# Altium schematic sheet CW313 Power Supplies.SchDoc: Power Supplies
size Letter; Organization: NewAE Technology Inc.; Address1: 1083 Queen St., Suite 196; Address2: Halifax; Address3: NS; Address4: Canada B3H 0B2; SheetNumber: 3; SheetTotal: 4; SheetApproved: YES
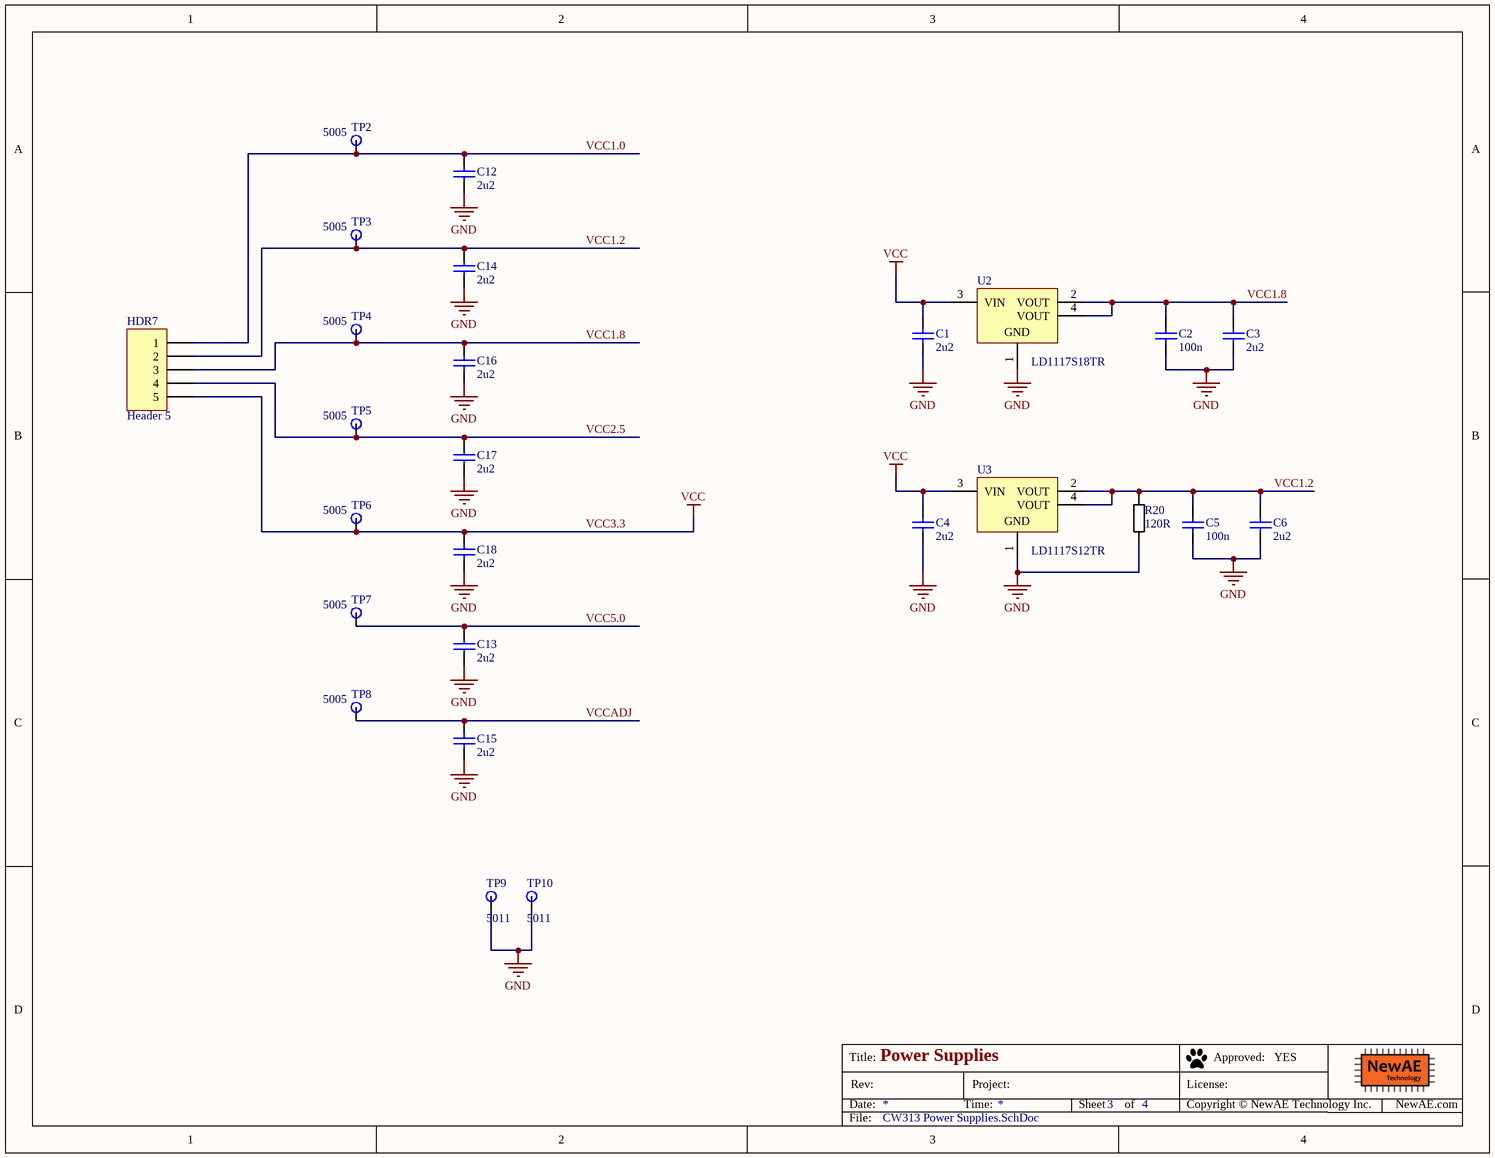
[diagram p0: CW313 Power Supplies.SchDoc]

## Parts
C1  2u2  [CAPC0603_M]
C2  100n  [CAPC0603_M]
C3  2u2  [CAPC0603_M]
C4  2u2  [CAPC0603_M]
C5  100n  [CAPC0603_M]
C6  2u2  [CAPC0603_M]
C12  2u2  [CAPC0603_M]
C13  2u2  [CAPC0603_M]
C14  2u2  [CAPC0603_M]
C15  2u2  [CAPC0603_M]
C16  2u2  [CAPC0603_M]
C17  2u2  [CAPC0603_M]
C18  2u2  [CAPC0603_M]
HDR7  Header 5  [HDR1X5]
R20  120R  [RESC1608X55N]
TP2  5005  [KEYSTONE5008]
TP3  5005  [KEYSTONE5008]
TP4  5005  [KEYSTONE5008]
TP5  5005  [KEYSTONE5008]
TP6  5005  [KEYSTONE5008]
TP7  5005  [KEYSTONE5008]
TP8  5005  [KEYSTONE5008]
TP9  5011  [KEYSTONE5011]
TP10  5011  [KEYSTONE5011]
U2  LD1117S18TR  [SOT-223_M]
U3  LD1117S12TR  [SOT-223_M]

## Nets
GND: C1.2 C2.2 C3.2 C4.2 C5.2 C6.2 C12.2 C13.2 C14.2 C15.2 C16.2 C17.2 C18.2 R20.2 TP9.1 TP10.1 U2.1(GND) U3.1(GND)
VCC3.3: C1.1 C4.1 C18.1 HDR7.5 TP6.1 U2.3(VIN) U3.3(VIN)  [also labelled VCC]
VCC1.0: C12.1 HDR7.1 TP2.1
VCC1.2: C5.1 C6.1 C14.1 HDR7.2 R20.1 TP3.1 U3.2(VOUT) U3.4(VOUT)
VCC1.8: C2.1 C3.1 C16.1 HDR7.3 TP4.1 U2.2(VOUT) U2.4(VOUT)
VCC2.5: C17.1 HDR7.4 TP5.1
VCC5.0: C13.1 TP7.1
VCCADJ: C15.1 TP8.1

## Notes on the sheet
- Title:
- Date:
- Rev:
- Time:
- Project:
- Sheet
- of
- License:
- Copyright © NewAE Technology Inc.
- Approved:
- NewAE.com
- File:

## Library data of the parts
C1 C3 C4 C6 C12-C18 = CCHIP-2u2-0603-16V: 2u2, 0603; Manufacture 1: Taiyo Yuden; Manufacture Part Number 1: EMK107BJ225KA-T; Component Group: Capacitor; Case-EIA: 0603; Case-Metric: 1608; Rated Voltage: 16VDC; Part Number: CCHIP-2u2-0603-16V; Footprint: 0603; Pin Count: 2; Supplier 1: Digi-Key; Supplier Part Number 1: 587-1430-1-ND; Value: 2u2; Mounting Technology: SMT; Component Kind: Standard; Component Type: Standard
C2 C5 = CCHIP-100n-0603: 100n, 0603; Manufacture 1: Kemet; Manufacture Part Number 1: C0603C104K5RACTU; Component Group: Capacitor; Case-EIA: 0603; Case-Metric: 1608; Rated Voltage: 50VDC; Part Number: CCHIP-100n-0603; Footprint: 0603; Pin Count: 2; Supplier 1: Digi-Key; Supplier Part Number 1: 399-5089-2-ND; Value: 100n; Mounting Technology: SMT; Component Kind: Standard; Component Type: Standard
HDR7 = Header 5: Header, 5-Pin; LatestRevisionDate: 17-Jul-2002; LatestRevisionNote: Re-released for DXP Platform.; Publisher: Altium Limited
R20 = RCHIP-120R-0603: 120R res, 0603, 1%, 1/10W; Manufacture 1: Yageo; Manufacture Part Number 1: RC0603FR-07120RL; Component Group: Resistor; Case-EIA: 0603; Case-Metric: 1608; Rated Power: 0.1W; Rated Voltage: 75VDC; Part Number: RCHIP-120R-0603; Footprint: 0603; Pin Count: 2; Supplier 1: Digi-Key; Supplier Part Number 1: 311-120HRCT-ND; Value: 120R; Tolerance: 1%; Mounting Technology: SMT; Temperature Range: -55C to 155C; Component Kind: Standard; Component Type: Standard
TP2-TP8 = KEYSTONE_5005: TEST POINT PC COMPACT .063"D RED; Part Number: KEYSTONE_5005; Component Group: Test Point; Pin Count: 1; Supplier 1: Digi-Key; Supplier Part Number 1: 36-5008-ND; Mounting Technology: Through-hole; Component Kind: Standard; Component Type: Standard
TP9 TP10 = KEYSTONE_5011: TEST POINT PC MULTI PURPOSE BLK; Part Number: KEYSTONE_5011; Component Group: Test Point; Pin Count: 1; Supplier 1: Digi-Key; Supplier Part Number 1: 36-5011-ND; Mounting Technology: Through-hole; Component Kind: Standard; Component Type: Standard
U2 = CMP-0244-00308-1: Fixed Low Drop Positive Voltage Regulator, 1.8V, 4-Pin SOT-223, Tape and Reel; ComponentLink1URL: http://www.st.com; PackageReference: SOT-223; PackageDescription: 4-Pin SOT-223 Package, 6.5 x 3.5 mm Body, 2.3 mm Pitch, 7 mm Lead Span; ComponentLink2URL: http://www.st.com/internet/com/TECHNICAL_RESOURCES/TECHNICAL_LITERATURE/DATASHEET/CD00000544.pdf; ComponentLink2Description: Datasheet; ComponentLink1Description: Manufacturer URL; DatasheetVersion: 1/11/2011; PackageVersion: 2010; Supplier 1: Digi-Key; Supplier Part Number 1: 497-7308-1-ND
U3 = CMP-0244-00318-1: Fixed Low Drop Positive Voltage Regulator, 1.2V, 4-Pin SOT-223, Tape and Reel; PackageDescription: 4-Pin SOT-223 Package, 6.5 x 3.5 mm Body, 2.3 mm Pitch, 7 mm Lead Span; PackageVersion: 2010; ComponentLink2Description: Datasheet; PackageReference: SOT-223; ComponentLink2URL: http://www.st.com/internet/com/TECHNICAL_RESOURCES/TECHNICAL_LITERATURE/DATASHEET/CD00000544.pdf; ComponentLink1Description: Manufacturer URL; DatasheetVersion: 1/11/2011; ComponentLink1URL: http://www.st.com; Supplier 1: Digi-Key; Supplier Part Number 1: 497-4240-1-ND